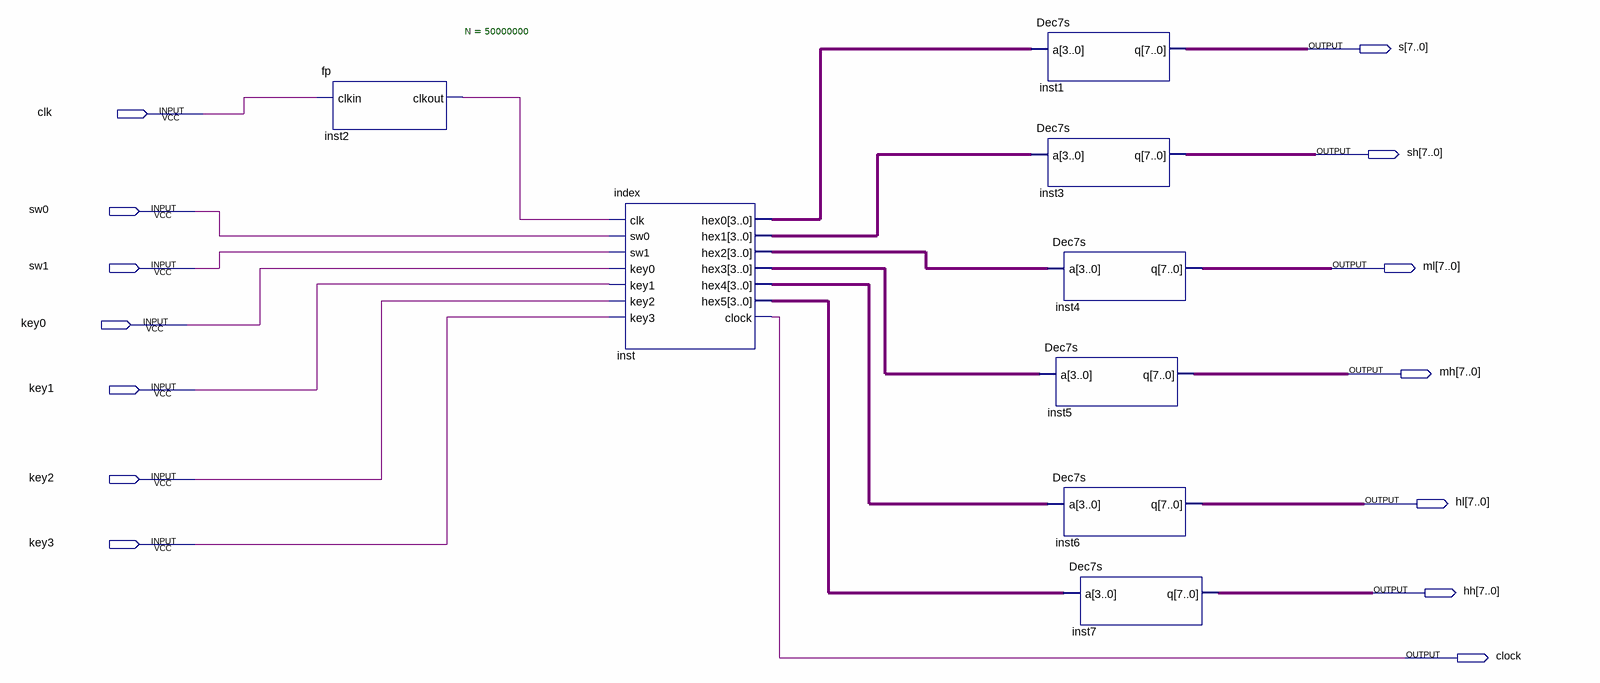
[diagram p0: schematic sheet]
// Quartus schematic extre.bdf as structural Verilog: 8 symbols, 14 pins
module extre (
  input  clk,
  input  sw0,
  input  sw1,
  input  key0,
  input  key1,
  input  key2,
  input  key3,
  output [7:0] s,
  output [7:0] sh,
  output [7:0] ml,
  output [7:0] mh,
  output [7:0] hl,
  output [7:0] hh,
  output clock
);

  wire inst2_clkout;
  wire [3:0] inst_hex0, inst_hex1, inst_hex2, inst_hex3, inst_hex4, inst_hex5;

  fp #(.N(50000000)) inst2 (.clkin(clk), .clkout(inst2_clkout));
  index inst (
    .clk(inst2_clkout), .sw0(sw0), .sw1(sw1), .key0(key0), .key1(key1), .key2(key2), .key3(key3),
    .hex0(inst_hex0), .hex1(inst_hex1), .hex2(inst_hex2), .hex3(inst_hex3), .hex4(inst_hex4),
    .hex5(inst_hex5), .clock(clock));
  Dec7s inst1 (.a(inst_hex0), .q(s));
  Dec7s inst3 (.a(inst_hex1), .q(sh));
  Dec7s inst4 (.a(inst_hex2), .q(ml));
  Dec7s inst5 (.a(inst_hex3), .q(mh));
  Dec7s inst6 (.a(inst_hex4), .q(hl));
  Dec7s inst7 (.a(inst_hex5), .q(hh));
endmodule
